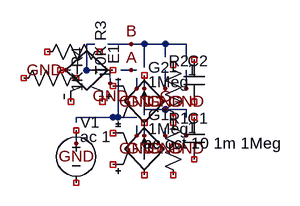
[diagram p0: schematic venable.asc]
venable.asc, the LTspice schematic file:
Version 3
SHEET 1 892 692
WIRE 400 300 400 288
WIRE 400 268 400 260
WIRE 400 260 432 260
WIRE 464 260 464 272
WIRE 464 288 464 300
WIRE 432 300 432 288
WIRE 432 268 432 260
WIRE 432 260 464 260
WIRE 388 300 388 284
WIRE 296 272 360 272
WIRE 400 228 400 216
WIRE 400 196 400 160
WIRE 464 160 464 184
WIRE 464 200 464 228
WIRE 432 228 432 200
WIRE 432 180 432 160
WIRE 388 228 388 212
WIRE 280 200 288 200
WIRE 308 200 312 200
WIRE 312 200 312 160
WIRE 312 200 344 200
WIRE 312 160 324 160
WIRE 432 160 464 160
WIRE 296 272 296 280
WIRE 296 300 296 312
WIRE 348 212 348 220
WIRE 360 212 360 272
WIRE 360 272 388 272
WIRE 380 200 388 200
WIRE 364 200 380 200
WIRE 344 160 380 160
WIRE 380 160 400 160
WIRE 400 160 432 160
FLAG 400 300 GND
FLAG 432 300 GND
FLAG 464 300 GND
FLAG 388 300 GND
FLAG 400 228 GND
FLAG 432 228 GND
FLAG 464 228 GND
FLAG 388 228 GND
FLAG 280 200 GND
FLAG 296 312 GND
FLAG 348 220 GND
FLAG 380 160 B
FLAG 380 200 A
FLAG 432 260 C
SYMBOL G2 400 264 R0
WINDOW 0 6 4 Left 0
WINDOW 3 6 26 Left 0
SYMATTR InstName G1
SYMATTR Value 1Meg
SYMBOL res 428 264 R0
WINDOW 0 9 10 Left 0
WINDOW 3 9 19 Left 0
SYMATTR InstName R1
SYMATTR Value 1
SYMBOL cap 460 272 R0
WINDOW 0 6 2 Left 0
WINDOW 3 6 16 Left 0
SYMATTR InstName C1
SYMATTR Value 1
SYMBOL g2 400 192 R0
WINDOW 0 6 4 Left 0
WINDOW 3 6 26 Left 0
SYMATTR InstName G2
SYMATTR Value 1Meg
SYMBOL res 428 176 R0
WINDOW 0 9 10 Left 0
WINDOW 3 9 19 Left 0
SYMATTR InstName R2
SYMATTR Value 1
SYMBOL cap 460 184 R0
WINDOW 0 6 2 Left 0
WINDOW 3 6 16 Left 0
SYMATTR InstName C2
SYMATTR Value 1
SYMBOL res 348 156 R90
WINDOW 0 0 14 Right 0
WINDOW 3 8 14 Left 0
SYMATTR InstName R3
SYMATTR Value 10K
SYMBOL res 312 196 R90
WINDOW 0 0 14 Right 0
WINDOW 3 8 14 Left 0
SYMATTR InstName R4
SYMATTR Value 1K
SYMBOL voltage 296 276 R0
WINDOW 0 6 4 Left 0
WINDOW 3 6 26 Left 0
SYMATTR InstName V1
SYMATTR Value ac 1
SYMBOL e 368 200 M270
WINDOW 0 9 14 Left 0
WINDOW 3 -14 27 Left 0
SYMATTR InstName E1
SYMATTR Value 1
text 392 312 Left 0 !.ac oct 10 1m 1Meg

The netlist it stands for:
* venable.asc
* G1: 1Meg (symbol G2 not certain, pin order unknown); nets seen at it: 
R1 NC_05 NC_06 1
C1 NC_07 NC_08 1
* G2: 1Meg (symbol g2 not certain, pin order unknown); nets seen at it: GND, N001
R2 NC_11 NC_12 1
C2 NC_13 NC_14 1
R3 NC_15 NC_16 10K
R4 NC_17 NC_18 1K
V1 NC_19 NC_20 ac 1
* E1: 1 (symbol e not certain, pin order unknown); nets seen at it: 
.ac oct 10 1m 1Meg
.backanno
.end